# EAGLE design judo-devkit_v1 (EAGLE 9.6.2)

## Sheet 1 of 3
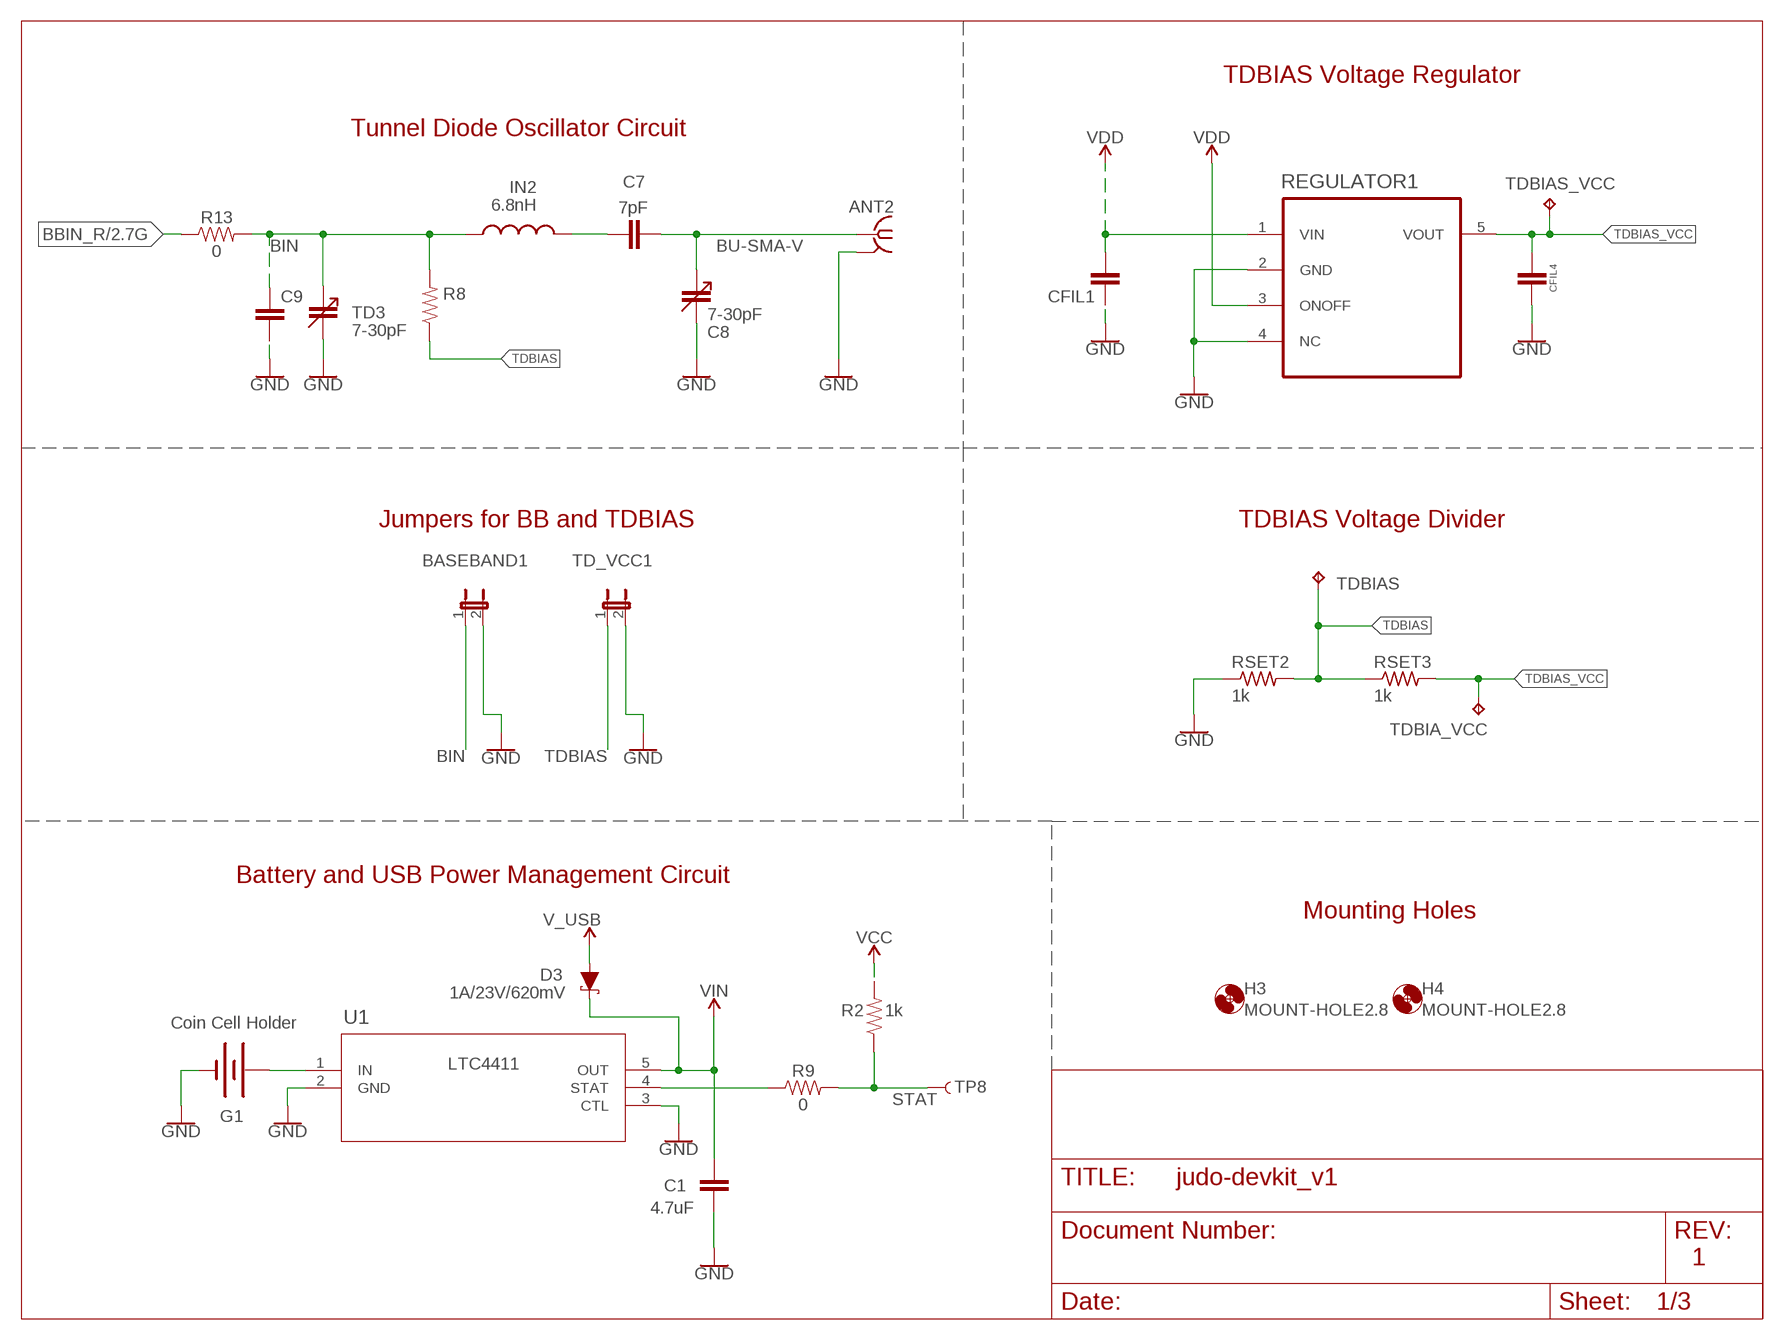
[diagram p0: schematic, sheet 1]

### Parts
BASEBAND1  JP1E  [JP1]
C1  4.7uF  CAPACITOR  [C0603]
C7  7pF  CAPACITOR  [C0603]
C8  7-30pF  CAP_ADJSMD  [CTZ3]
C9  CAP-0603  [0603]
CFIL1  0805_1  [0805_1PRIMARY]
CFIL4  0805_1  [0805_1PRIMARY]
D3  1A/23V/620mV  DIODE-SCHOTTKY-BAT20J  [SOD-323]
G1  Coin Cell Holder  BATTERY-20MM_SMD_4LEGS  [BATTCON_20MM_4LEGS]
H3  MOUNT-HOLE2.8  [2,8]
H4  MOUNT-HOLE2.8  [2,8]
IN2  6.8nH  0603_1  [0603_1PRIMARY]
R2  1k  1KOHM-0603-1/10W-1%  [0603]
R8  RESISTOR0805-RES  [0805]
R9  0  0OHM-0603-1/10W  [0603]
R13  0  0OHM-0603-1/10W  [0603]
REGULATOR1  S-1313B20  [SOT23-5]
RSET2  1k  R-US_R0603  [R0603]
RSET3  1k  R-US_R0603  [R0603]
TD3  7-30pF  CAP_ADJSMD  [CTZ3]
TD_VCC1  JP1E  [JP1]
TDBIA_VCC  TPPAD1-17  [P1-17]
TDBIAS  TPPAD1-17  [P1-17]
TDBIAS_VCC  TPPAD1-17  [P1-17]
TP8  TEST-POINT3X5  [PAD.03X.05]
TUNNELDIODE2  BU-SMA-V  [BU-SMA-V]
U1  LTC4411ES5TRMPBF  [SOT-5_S_LIT]

### Nets
ANT2: C7.2 C8.+ TUNNELDIODE2.1
BBIN_R: R13.1 ; also sheet 2
BIN: BASEBAND1.1 C9.1 IN2.1 R8.2 R13.2 TD3.+
GND: BASEBAND1.2 C1.1 C8.- C9.2 CFIL1.1 CFIL4.2 G1.NEGATIVE(-) REGULATOR1.2(GND) REGULATOR1.4(NC) RSET2.1 TD3.- TD_VCC1.2 TUNNELDIODE2.2 TUNNELDIODE2.3 TUNNELDIODE2.4 TUNNELDIODE2.5 U1.2(GND) U1.3(CTL) ; also sheet 2,3
N$1: G1.POSITIVE@1(+) G1.POSITIVE@2(+) G1.POSITIVE@3(+) G1.POSITIVE@4(+) U1.1(IN)
N$3: R9.1 U1.4(STAT)
N$5: C7.1 IN2.2
STAT: R2.1 R9.2 TP8.1
TDBIAS: R8.1 RSET2.2 RSET3.1 TD_VCC1.1 TDBIAS.TP
TDBIAS_VCC: CFIL4.1 REGULATOR1.5(VOUT) RSET3.2 TDBIA_VCC.TP TDBIAS_VCC.TP
V_USB: D3.A ; also sheet 2,3
VCC: R2.2 ; also sheet 2
VDD: CFIL1.2 REGULATOR1.1(VIN) REGULATOR1.3(ONOFF) ; also sheet 2,3
VIN: C1.2 D3.C U1.5(OUT) ; also sheet 2

### Notes on the sheet
- TDBIAS Voltage Regulator
- Tunnel Diode Oscillator Circuit
- Jumpers for BB and TDBIAS | TDBIAS Voltage Divider
- Battery and USB Power Management Circuit
- Mounting Holes
- 1

## Sheet 2 of 3
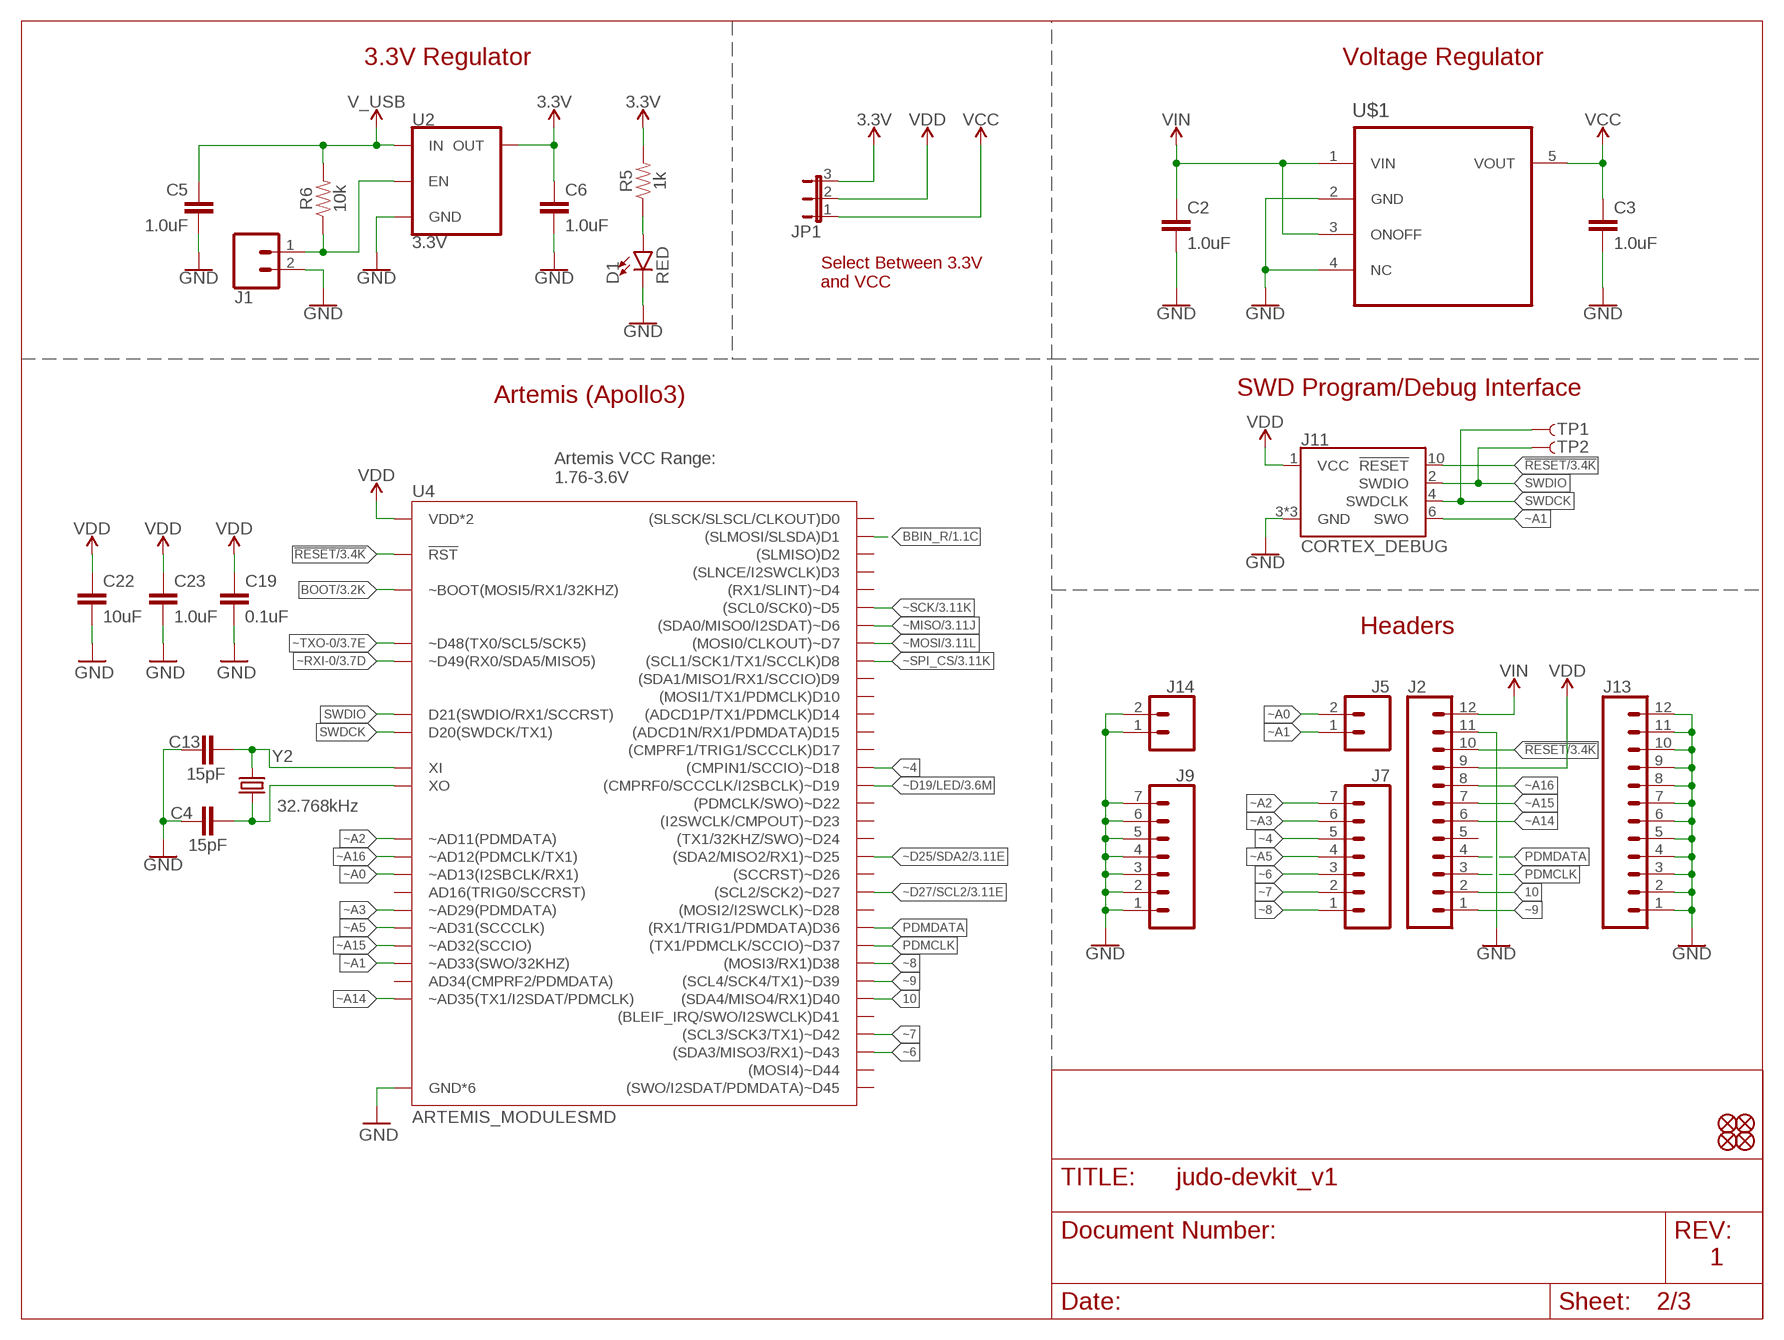
[diagram p1: schematic, sheet 2]

### Parts
C2  1.0uF  1.0UF-0402T-16V-10%  [0402-TIGHT]
C3  1.0uF  1.0UF-0402T-16V-10%  [0402-TIGHT]
C4  15pF  15PF-0603-50V-5%  [0603]
C5  1.0uF  1.0UF-0402T-16V-10%  [0402-TIGHT]
C6  1.0uF  1.0UF-0402T-16V-10%  [0402-TIGHT]
C13  15pF  15PF-0603-50V-5%  [0603]
C19  0.1uF  0.1UF-0402T-16V-10%  [0402-TIGHT]
C22  10uF  10UF-0603-6.3V-20%  [0603]
C23  1.0uF  1.0UF-0402T-16V-10%  [0402-TIGHT]
D1  RED  LED-RED0603  [LED-0603]
FD1  FIDUCIALUFIDUCIAL  [FIDUCIAL-MICRO]
FD2  FIDUCIALUFIDUCIAL  [FIDUCIAL-MICRO]
FD3  FIDUCIALUFIDUCIAL  [FIDUCIAL-MICRO]
FD4  FIDUCIALUFIDUCIAL  [FIDUCIAL-MICRO]
J1  CONN_021X02_NO_SILK  [1X02_NO_SILK]
J2  CONN_12NO_SILK  [1X12_NO_SILK]
J5  CONN_021X02_NO_SILK  [1X02_NO_SILK]
J7  CONN_07NO_SILK  [1X07_NO_SILK]
J9  CONN_07NO_SILK  [1X07_NO_SILK]
J11  CORTEX_DEBUG  CORTEX_JTAG_DEBUG_MINIMUM_PTH_NS  [2X5-PTH-1.27MM-NO_SILK]
J13  CONN_12NO_SILK  [1X12_NO_SILK]
J14  CONN_021X02_NO_SILK  [1X02_NO_SILK]
JP1  JP2E  [JP2]
R5  1k  1KOHM-0603-1/10W-1%  [0603]
R6  10k  10KOHM-0603-1/10W-1%  [0603]
TP1  TEST-POINT3X5  [PAD.03X.05]
TP2  TEST-POINT3X5  [PAD.03X.05]
U2  3.3V  V_REG_AP2112K-3.3V  [SOT23-5]
U4  ARTEMIS_MODULESMD  [ARTEMIS_FP]
U$1  CUSTOMCOMPONENTS_S-1313B20  [CUSTOMCOMPONENTS_SOT23-5]
Y2  32.768kHz  CRYSTAL-32.768KHZSMD-3.2X1.5  [CRYSTAL-SMD-3.2X1.5MM]

### Nets
3.3V: C6.1 JP1.3 R5.2 U2.5(OUT) ; also sheet 3
10: J2.2 U4.D40((SDA4/MISO4/RX1)D40)
!RESET: J2.10 J11.10(!RESET) U4.~RST(!RST) ; also sheet 3
BBIN_R: U4.D1((SLMOSI/SLSDA)D1) ; also sheet 1
BOOT: U4.BOOT(~BOOT(MOSI5/RX1/32KHZ)) ; also sheet 3
GND: C2.2 C3.2 C4.1 C5.2 C6.2 C13.1 C19.1 C22.2 C23.2 D1.C J1.2 J2.11 J9.1 J9.2 J9.3 J9.4 J9.5 J9.6 J9.7 J11.3(GND) J11.5(GND) J11.9(GND) J13.1 J13.2 J13.3 J13.4 J13.5 J13.6 J13.7 J13.8 J13.9 J13.10 J13.11 J13.12 J14.1 J14.2 U2.2(GND) U4.GND@1(GND*6) U4.GND@22(GND*6) U4.GND@38(GND*6) U4.GND@39(GND*6) U4.GND@47(GND*6) U4.GND@59(GND*6) U$1.2(GND) U$1.4(NC) ; also sheet 1,3
N$2: D1.A R5.1
N$7: C4.2 U4.XO Y2.P$2
N$8: C13.2 U4.XI Y2.P$1
PDMCLK: J2.3 U4.~D37((TX1/PDMCLK/SCCIO)~D37)
PDMDATA: J2.4 U4.D36((RX1/TRIG1/PDMDATA)D36)
SWDCK: J11.4(SWDCLK) TP1.1 U4.SWDCK(D20(SWDCK/TX1))
SWDIO: J11.2(SWDIO) TP2.1 U4.SWDIO(D21(SWDIO/RX1/SCCRST))
V_USB: C5.1 R6.2 U2.1(IN) ; also sheet 1,3
VCC: C3.1 JP1.1 U$1.5(VOUT) ; also sheet 1
VDD: C19.2 C22.1 C23.1 J2.9 J11.1(VCC) JP1.2 U4.VDD@36(VDD*2) U4.VDD@37(VDD*2) ; also sheet 1,3
VIN: C2.1 J2.12 U$1.1(VIN) U$1.3(ONOFF) ; also sheet 1
VREG_EN1: J1.1 R6.1 U2.3(EN)
~4: J7.5 U4.~D18((CMPIN1/SCCIO)~D18)
~6: J7.3 U4.~D43((SDA3/MISO3/RX1)~D43)
~7: J7.2 U4.~D42((SCL3/SCK3/TX1)~D42)
~8: J7.1 U4.D38((MOSI3/RX1)D38)
~9: J2.1 U4.~D39((SCL4/SCK4/TX1)~D39)
~A0: J5.2 U4.~AD13(~AD13(I2SBCLK/RX1))
~A1: J5.1 J11.6(SWO) U4.~AD33/SWO(~AD33(SWO/32KHZ))
~A2: J7.7 U4.~AD11(~AD11(PDMDATA))
~A3: J7.6 U4.~AD29(~AD29(PDMDATA))
~A5: J7.4 U4.~AD31(~AD31(SCCCLK))
~A14: J2.6 U4.~AD35(~AD35(TX1/I2SDAT/PDMCLK))
~A15: J2.7 U4.~AD32(~AD32(SCCIO))
~A16: J2.8 U4.~AD12(~AD12(PDMCLK/TX1))
~D19/LED: U4.~D19((CMPRF0/SCCCLK/I2SBCLK)~D19) ; also sheet 3
~D25/SDA2: U4.~D25((SDA2/MISO2/RX1)~D25) ; also sheet 3
~D27/SCL2: U4.~D27((SCL2/SCK2)~D27) ; also sheet 3
~MISO: U4.~D6((SDA0/MISO0/I2SDAT)~D6) ; also sheet 3
~MOSI: U4.D7((MOSI0/CLKOUT)~D7) ; also sheet 3
~RXI-0: U4.RXI-0(~D49(RX0/SDA5/MISO5)) ; also sheet 3
~SCK: U4.~D5((SCL0/SCK0)~D5) ; also sheet 3
~SPI_CS: U4.D8((SCL1/SCK1/TX1/SCCLK)D8) ; also sheet 3
~TXO-0: U4.TXO-0(~D48(TX0/SCL5/SCK5)) ; also sheet 3
Unconnected: J2.5 U4.AD16(AD16(TRIG0/SCCRST)) U4.AD34(AD34(CMPRF2/PDMDATA)) U4.D0((SLSCK/SLSCL/CLKOUT)D0) U4.D2((SLMISO)D2) U4.D3((SLNCE/I2SWCLK)D3) U4.D9((SDA1/MISO1/RX1/SCCIO)D9) U4.D10((MOSI1/TX1/PDMCLK)D10) U4.D14((ADCD1P/TX1/PDMCLK)D14) U4.D15((ADCD1N/RX1/PDMDATA)D15) U4.D17((CMPRF1/TRIG1/SCCCLK)D17) U4.D41((BLEIF_IRQ/SWO/I2SWCLK)D41) U4.~D4((RX1/SLINT)~D4) U4.~D22((PDMCLK/SWO)~D22) U4.~D23((I2SWCLK/CMPOUT)~D23) U4.~D24((TX1/32KHZ/SWO)~D24) U4.~D26((SCCRST)~D26) U4.~D28((MOSI2/I2SWCLK)~D28) U4.~D44((MOSI4)~D44) U4.~D45((SWO/I2SDAT/PDMDATA)~D45)

### Notes on the sheet
- 3.3V Regulator | Voltage Regulator
- Select Between 3.3V
  and VCC
- Artemis (Apollo3) | SWD Program/Debug Interface
- Artemis VCC Range:
  1.76-3.6V
- Headers
- 1

## Sheet 3 of 3
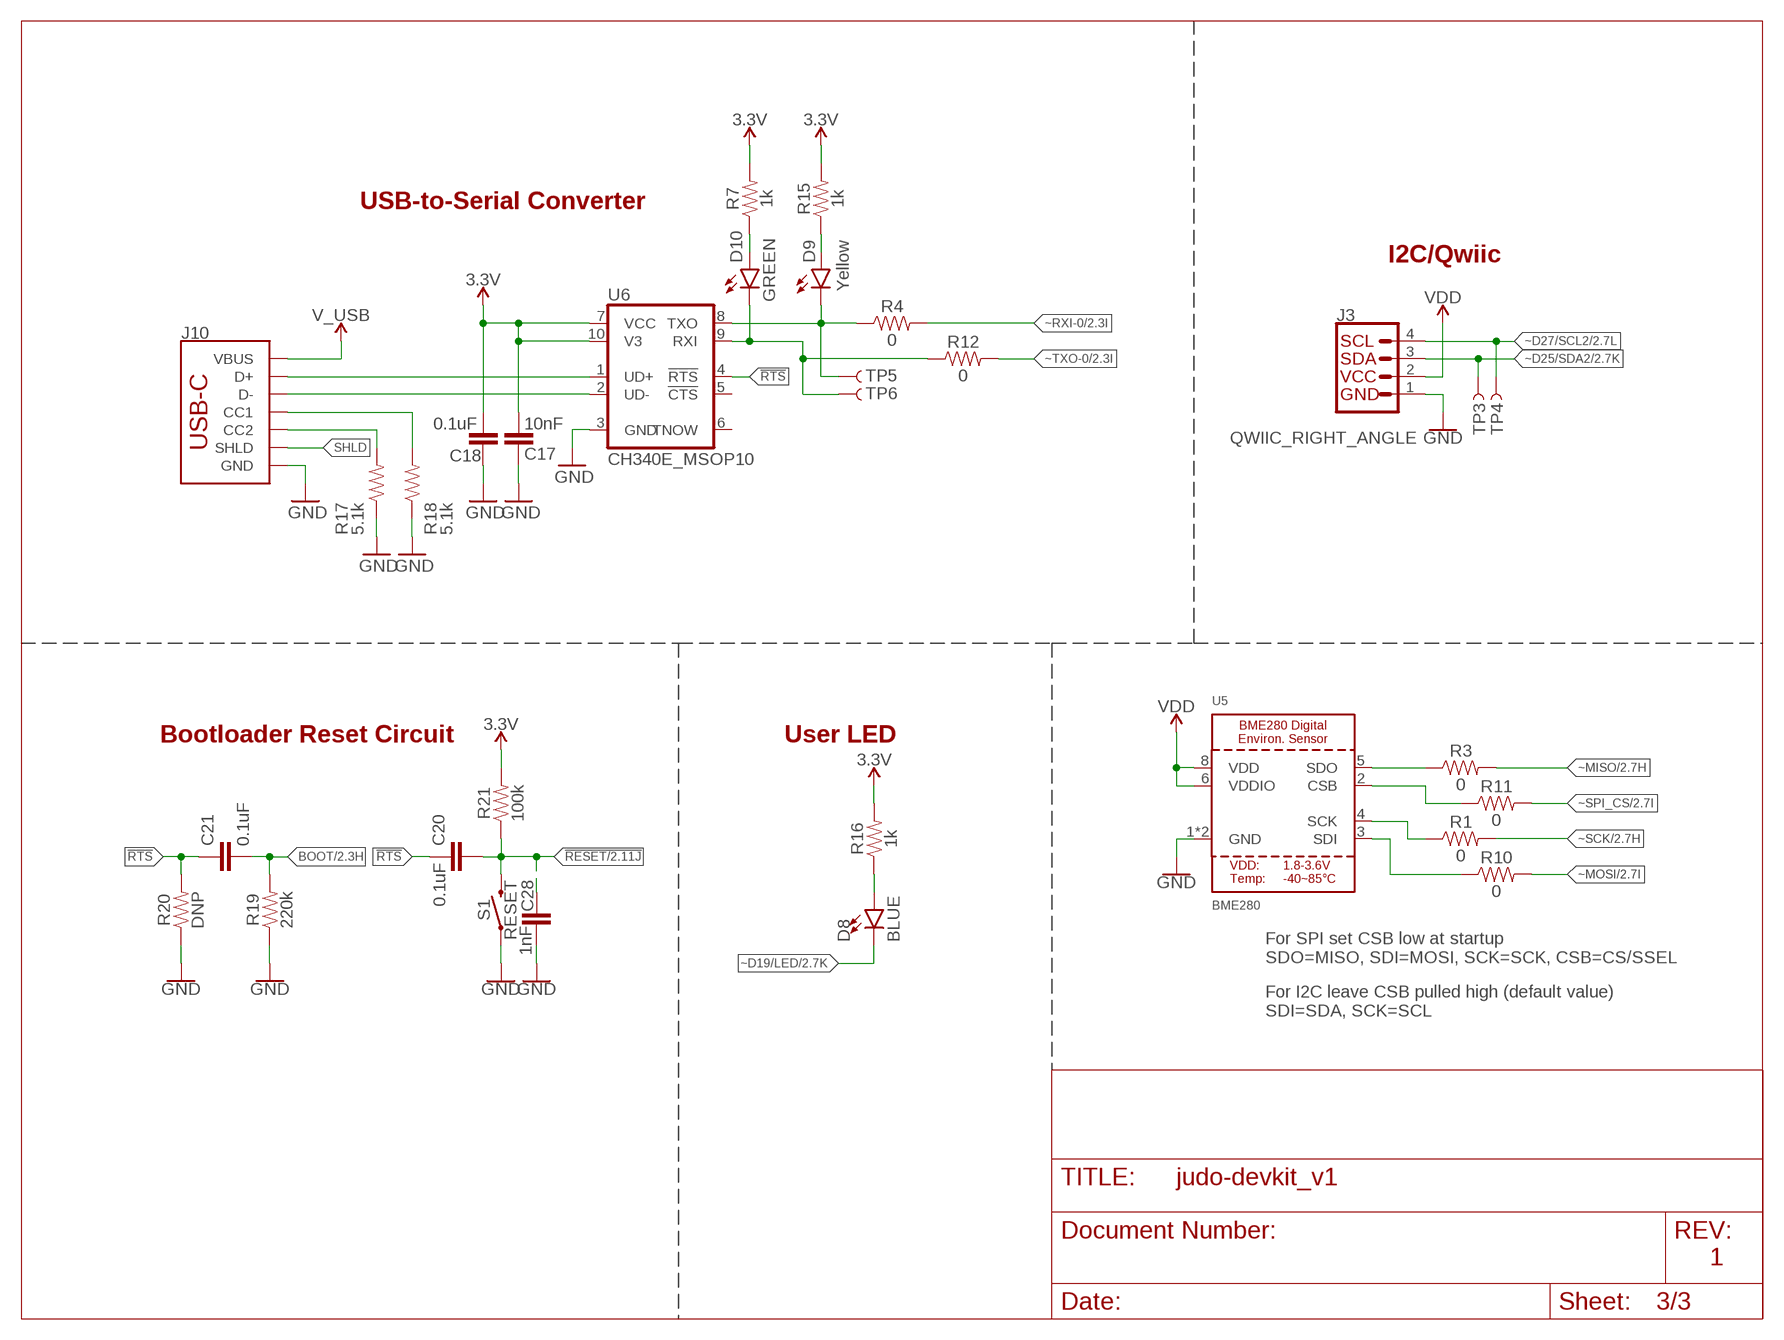
[diagram p2: schematic, sheet 3]

### Parts
C17  10nF  10NF-0603-50V-10%  [0603]
C18  0.1uF  0.1UF-0603-25V-(+80/-20%)  [0603]
C20  0.1uF  0.1UF-0603-25V-5%  [0603]
C21  0.1uF  0.1UF-0603-25V-5%  [0603]
C28  1nF  1.0NF/1000PF-0603-50V-10%  [0603]
D8  BLUE  LED-BLUE0603  [LED-0603]
D9  Yellow  LED-YELLOW0603  [LED-0603]
D10  GREEN  LED-GREEN0603  [LED-0603]
J3  QWIIC_RIGHT_ANGLE  QWIIC_CONNECTORJS-1MM  [JST04_1MM_RA]
J10  USB Female Type C Connector  USB_C_2-LAYER_PADS  [USB-C-16P-2LAYER-PADS]
R1  0  0OHM-0603-1/10W  [0603]
R3  0  0OHM-0603-1/10W  [0603]
R4  0  0OHM-0603-1/10W  [0603]
R7  1k  1KOHM-0603-1/10W-1%  [0603]
R10  0  0OHM-0603-1/10W  [0603]
R11  0  0OHM-0603-1/10W  [0603]
R12  0  0OHM-0603-1/10W  [0603]
R15  1k  1KOHM-0603-1/10W-1%  [0603]
R16  1k  1KOHM-0603-1/10W-1%  [0603]
R17  5.1k  5.1KOHM5.1KOHM-0603-1/10W-1%  [0603]
R18  5.1k  5.1KOHM5.1KOHM-0603-1/10W-1%  [0603]
R19  220k  220KOHM-0603-1/10W-1%  [0603]
R20  DNP  DNP-0603  [0603]
R21  100k  100KOHM-0603-1/10W-1%  [0603]
S1  RESET  MOMENTARY-SWITCH-SPST-SMD-4.6X2.8MM  [TACTILE_SWITCH_SMD_4.6X2.8MM]
TP3  TEST-POINT3X5  [PAD.03X.05]
TP4  TEST-POINT3X5  [PAD.03X.05]
TP5  TEST-POINT3X5  [PAD.03X.05]
TP6  TEST-POINT3X5  [PAD.03X.05]
U5  BME280  [BME280]
U6  CH340E_MSOP10  [MSOP10]

### Nets
3.3V: C17.1 C18.1 R7.2 R15.2 R16.2 R21.2 U6.7(VCC) U6.10(V3) ; also sheet 2
!RESET: C20.2 C28.1 R21.1 S1.3 S1.4 ; also sheet 2
!RTS: C20.1 C21.1 R20.2 U6.4(!RTS)
BOOT: C21.2 R19.2 ; also sheet 2
CC1: J10.A5(CC1) R18.2
CC2: J10.B5(CC2) R17.2
D+1: J10.A6(D+) J10.B6(D+) U6.1(UD+)
D-1: J10.A7(D-) J10.B7(D-) U6.2(UD-)
GND: C17.2 C18.2 C28.2 J3.1 J10.GND J10.GND2(GND) R17.1 R18.1 R19.1 R20.1 S1.1 S1.2 U5.1(GND) U5.7(GND) U6.3(GND) ; also sheet 1,2
N$4: R11.1 U5.2(CSB)
N$6: R3.1 U5.5(SDO)
N$9: D8.A R16.1
N$11: D10.A R7.1
N$12: D9.A R15.1
N$14: R1.1 U5.4(SCK)
N$15: R10.1 U5.3(SDI)
RXI-0_R: D9.C R4.1 TP5.1 U6.8(TXO)
SHLD: J10.SHLD1(SHLD) J10.SHLD2(SHLD) J10.SHLD3(SHLD) J10.SHLD4(SHLD)
TXO-0_R: D10.C R12.1 TP6.1 U6.9(RXI)
V_USB: J10.VBUS1(VBUS) J10.VBUS2(VBUS) ; also sheet 1,2
VDD: J3.2 U5.6(VDDIO) U5.8(VDD) ; also sheet 1,2
~D19/LED: D8.C ; also sheet 2
~D25/SDA2: J3.3 TP3.1 ; also sheet 2
~D27/SCL2: J3.4 TP4.1 ; also sheet 2
~MISO: R3.2 ; also sheet 2
~MOSI: R10.2 ; also sheet 2
~RXI-0: R4.2 ; also sheet 2
~SCK: R1.2 ; also sheet 2
~SPI_CS: R11.2 ; also sheet 2
~TXO-0: R12.2 ; also sheet 2
Unconnected: U6.5(!CTS) U6.6(TNOW)

### Notes on the sheet
- USB-to-Serial Converter
- I2C/Qwiic
- Bootloader Reset Circuit | User LED
- For SPI set CSB low at startup
  SDO=MISO, SDI=MOSI, SCK=SCK, CSB=CS/SSEL
- For I2C leave CSB pulled high (default value)
  SDI=SDA, SCK=SCL
- 1

## Library data of the parts
BASEBAND1 TD_VCC1 = jumper:JP1E: JUMPER
C1 C7 = Moo1.2:CAPACITOR
C2 C3 C5 C6 C23 = SparkFun-Capacitors:1.0UF: 1µF ceramic capacitors A capacitor is a passive two-terminal electrical component used to store electrical energy temporarily in an electric field.; PROD_ID: CAP-12417
C4 C13 = SparkFun-Capacitors:15PF: 15pF ceramic capacitors A capacitor is a passive two-terminal electrical component used to store electrical energy temporarily in an electric field.; PROD_ID: CAP-07881
C8 TD3 = SparkFun-Capacitors:CAP_ADJ: Variable, non-polarized capacitor
C9 = SparkFun-Capacitors:CAP
C17 = SparkFun-Capacitors:10NF: 0.01uF/10nF/10,000pF ceramic capacitors A capacitor is a passive two-terminal electrical component used to store electrical energy temporarily in an electric field. CAP-09321; PROD_ID: CAP-00867
C18 = SparkFun-Capacitors:0.1UF: 0.1µF ceramic capacitors A capacitor is a passive two-terminal electrical component used to store electrical energy temporarily in an electric field.; PROD_ID: CAP-00810
C19 = SparkFun-Capacitors:0.1UF: 0.1µF ceramic capacitors A capacitor is a passive two-terminal electrical component used to store electrical energy temporarily in an electric field.; PROD_ID: CAP-12416
C20 C21 = SparkFun-Capacitors:0.1UF: 0.1µF ceramic capacitors A capacitor is a passive two-terminal electrical component used to store electrical energy temporarily in an electric field.; PROD_ID: CAP-08604
C22 = SparkFun-Capacitors:10UF: 10.0µF ceramic capacitors A capacitor is a passive two-terminal electrical component used to store electrical energy temporarily in an electric field.; PROD_ID: CAP-11015
C28 = SparkFun-Capacitors:1.0NF/1000PF: 1nF/1,000pF ceramic capacitors A capacitor is a passive two-terminal electrical component used to store electrical energy temporarily in an electric field.; PROD_ID: CAP-07886
CFIL1 CFIL4 = Moo1.2:0805_1
D1 = SparkFun-LED:LED-RED: Red SMD LED Used in manufacturing of most products at SparkFun Packages: 0603 - KB - KingBright (DIO-17976) SMD 0603 package [Datasheet] <https://www.kingbrightusa.com/images/catalog/SPEC/APT1608SURCK.pdf> 0603 - (DIO-00819, has gone EOL) SMD 0603 package 0603 SMART - SMD 0603 SMART package ( more efficient and expensive)[Product Link] <http://www.osram-os.com/Graphics/XPic2/00077099_0.pdf> 1206 - SMD1206 package [Product Link] <https://www.sparkfun.com/datasheets/DevTools/LilyPad/Q150OVS4.pdff> SparkFun Products: Pro Mini 328 -5V <https://www.sparkfun.com/products/821> RedBoard <https://www.sparkfun.com/products/12757> IOIO-OTG <https://www.sparkfun.com/products/13613>; PROD_ID: DIO-00819
D3 = SparkFun-DiscreteSemi:DIODE-SCHOTTKY: Schottky diode A Schottky diode is a semiconductor diode which has a low forward voltage drop and a very fast switching action.; PROD_ID: DIO-11623
D8 = SparkFun-LED:LED-BLUE: Blue SMD LED Used in manufacturing of various products at SparkFun Packages: 0603 - SMD 0603 package [Product Link] <http://www.digikey.com/product-detail/en/SMLE12BC7TT86/511-1589-2-ND/1641808> 1206 - SMD1206 package [Product Link] <http://www.digikey.com/product-detail/en/lite-on-inc/LTST-C150TBKT/160-1643-1-ND/573584> SparkFun Products: ESP8266 Thing-Dev Board <https://www.sparkfun.com/products/13711> RedBoard <https://www.sparkfun.com/products/12757>; PROD_ID: DIO-08575
D9 = SparkFun-LED:LED-YELLOW: Yellow SMD LED Used in manufacturing several products at SparkFun. Packages: 0603 - SMD 0603 package[Product Link] <http://www.kingbrightusa.com/product.asp?catalog_name=LED&product_id=APT1608SYCK> 0603 -SMART - SMART SMD 0603 package (more efficient/more expensive) [Product Link] <http://www.osram-os.com/osram_os/en/products/product-catalog/led-light-emitting-diodes/smartled-0603/ly-l29k/index.jsp> LilyPad - SMD1206 package[Product Datasheet] <https://www.sparkfun.com/datasheets/DevTools/LilyPad/Q150YUS4.pdf> SparkFun Products: Blynk Board <https://www.sparkfun.com/products/13794> IOIO-OTG <https://www.sparkfun.com/products/13613> XBee Explorer Serial <https://www.sparkfun.com/products/13225>; PROD_ID: DIO-09003
D10 = SparkFun-LED:LED-GREEN: Green SMD LED Used in manufacturing of various products at SparkFun Packages: 0603 - SMD 0603 package [Product Link] <http://www.futureelectronics.com/en/technologies/semiconductors/optoelectronics/leds/Pages/9894312-LTST-C190GKT.aspx?CrossPart=HSMG-C190&IM=0> LilyPad 1206 - SMD1206 LilyPad package [Product Link] <http://www.futureelectronics.com/en/Technologies/Product.aspx?ProductID=IN150NGHARVATEKCORPORATION2049943&IM=0> 1206 - SMD1206 package [Product Link] <http://www.futureelectronics.com/en/technologies/semiconductors/optoelectronics/leds/Pages/8315665-LTST-C150KGKT.aspx?IM=0> 1206 Bottom Mount -SMD 1206 Bottom Mount [Product Link] <http://www.digikey.com/product-detail/en/lite-on-inc/LTST-C230KGKT/160-1456-1-ND/386854> SparkFun Products: Pro Mini 328 -5V <https://www.sparkfun.com/products/821> RedBoard <https://www.sparkfun.com/products/12757> MP3 Trigger <https://www.sparkfun.com/products/13720> Makey Makey <https://www.sparkfun.com/products/11076>; PROD_ID: DIO-00821
FD1-FD4 = SparkFun-Aesthetics:FIDUCIAL: Fiducial Alignment Points Point-of-reference for pick-and-place machines and other optical instruments.
G1 = SparkFun-Batteries:BATTERY: Battery - Single Cell A variety of battery chemistries, sizes, and footprints. Device List: 20MM_PTH - Coin Cell Battery Holder - 20mm (PTH) <https://www.sparkfun.com/products/783> 20MM_PTH_KIT- Coin Cell battery Holder - 20 mm (PTH) <http://www.sparkfun.com/products/783>kit version with special mask 6.8MM_PTH - Coin Cell Battery Holder - 6.8MM(SMD) <https://www.digikey.com/product-detail/en/seiko-instruments/MS621FE-FL11E/728-1057-ND/1889208?WT.srch=1&gclid=CNOQ5a6LzdQCFZS2wAodXCkE0g> 12MM_SMD - Coin Cell Battery Holder - 12mm (SMD) <https://www.sparkfun.com/products/10592> 12MM_PTH - Coin Cell Battery Holder - 12mm (PTH) <https://www.sparkfun.com/products/7948> 20MM_SMD - 20mm Coin Cell Battery Holder (SMD) (2 legs) Used on the Big Time Watch Kit <https://www.sparkfun.com/products/11734> 20MM_SMD_4LEGS - Coin Cell Battery Holder - 20mm (SMD) <https://www.sparkfun.com/products/11892> 20MM_SMD_4LEGS_OVERPASTE - Coin Cell Battery Holder - 20mm (SMD) <https://www.sparkfun.com/products/11892> (Over-paste on the legs) 24.5MM_PTH - Coin Cell Battery Holder - 24.5mm (PTH) <https://www.sparkfun.com/products/8863> 9V - 9V Battery Holder - PC Mount Used on the SparkFun SparkPunk Sound Kit <https://www.sparkfun.com/products/11177> and SparkFun SparkPunk Sequencer Kit <https://www.sparkfun.com/products/12707> 18650 - Battery Holder - 18650 (PTH) <https://www.sparkfun.com/products/13113> AA - Battery Holder - 1xAA (PTH) <https://www.sparkfun.com/products/7949> AAA - Battery Holder - 1xAAA (PTH) <https://www.sparkfun.com/products/12718> AA_KIT - Battery Holder - 1xAA (PTH) <https://www.sparkfun.com/products/7949> Special kit package - pads only have exposed copper on one side of the board. AAA_KIT - Battery Holder - 1xAAA (PTH) <https://www.sparkfun.com/products/12718> Special kit package - pads only have exposed copper on one side of the board.; PROD_ID: BATT-10373; SF_SKU: PRT-11892
H3 H4 = holes:MOUNT-HOLE: MOUNTING HOLE with drill center marker
IN2 = Moo1.2:0603_1
J1 J5 J14 = SparkFun-Connectors:CONN_02: Multi connection point. Often used as Generic Header-pin footprint for 0.1 inch spaced/style header connections On any of the 0.1 inch spaced packages, you can populate with these: Break Away Headers - Straight <https://www.sparkfun.com/products/116> (PRT-00116) Break Away Male Headers - Right Angle <https://www.sparkfun.com/products/553> (PRT-00553) Female Headers <https://www.sparkfun.com/products/115> (PRT-00115) Break Away Headers - Machine Pin <https://www.sparkfun.com/products/117> (PRT-00117) Break Away Female Headers - Swiss Machine Pin <https://www.sparkfun.com/products/743> (PRT-00743) For SCREWTERMINALS and SPRING TERMINALS visit here: Screw Terimnals on SparkFun.com <https://www.sparkfun.com/search/results?term=Screw+Terminals> (5mm/3.5mm/2.54mm spacing) This device is also useful as a general connection point to wire up your design to another part of your project. Our various solder wires solder well into these plated through hole pads. Hook-Up Wire - Assortment (Stranded, 22 AWG) <https://www.sparkfun.com/products/11375> (PRT-11375) Hook-Up Wire - Assortment (Solid Core, 22 AWG) <https://www.sparkfun.com/products/11367> (PRT-11367) View the entire wire category on our website here <https://www.sparkfun.com/categories/141> Special notes: Molex polarized connector foot print use with: PRT-08233 with associated crimp pins and housings. 2.54_SCREWTERM for use with PRT-10571. 3.5mm Screw Terminal footprints for PRT-08084 5mm Screw Terminal footprints for use with PRT-08432
J2 J13 = SparkFun-Connectors:CONN_12: Multi connection point. Often used as Generic Header-pin footprint for 0.1 inch spaced/style header connections On any of the 0.1 inch spaced packages, you can populate with these: Break Away Headers - Straight <https://www.sparkfun.com/products/116> (PRT-00116) Break Away Male Headers - Right Angle <https://www.sparkfun.com/products/553> (PRT-00553) Female Headers <https://www.sparkfun.com/products/115> (PRT-00115) Break Away Headers - Machine Pin <https://www.sparkfun.com/products/117> (PRT-00117) Break Away Female Headers - Swiss Machine Pin <https://www.sparkfun.com/products/743> (PRT-00743) For SCREWTERMINALS and SPRING TERMINALS visit here: Screw Terimnals on SparkFun.com <https://www.sparkfun.com/search/results?term=Screw+Terminals> (5mm/3.5mm/2.54mm spacing) This device is also useful as a general connection point to wire up your design to another part of your project. Our various solder wires solder well into these plated through hole pads. Hook-Up Wire - Assortment (Stranded, 22 AWG) <https://www.sparkfun.com/products/11375> (PRT-11375) Hook-Up Wire - Assortment (Solid Core, 22 AWG) <https://www.sparkfun.com/products/11367> (PRT-11367) View the entire wire category on our website here <https://www.sparkfun.com/categories/141> Special notes: Molex polarized connector foot print use with SKU : PRT-08231 with associated crimp pins and housings. 1MM SMD Version SKU: PRT-10208 NOTES ON THE VARIANTS LOCK and LOCK_LONGPADS... This footprint was designed to help hold the alignment of a through-hole component (i.e. 6-pin header) while soldering it into place. You may notice that each hole has been shifted either up or down by 0.005 of an inch from it's more standard position (which is a perfectly straight line). This slight alteration caused the pins (the squares in the middle) to touch the edges of the holes. Because they are alternating, it causes a "brace" to hold the component in place. 0.005 has proven to be the perfect amount of "off-center" position when using our standard breakaway headers. Although looks a little odd when you look at the bare footprint, once you have a header in there, the alteration is very hard to notice. Also,if you push a header all the way into place, it is covered up entirely on the bottom side.
J3 = SparkFun-Connectors:QWIIC_CONNECTOR: SparkFun I2C Standard Qwiic Connector An SMD 1mm pitch JST connector makes it easy and quick (get it? Qwiic?) to connect I2C devices to each other. The Qwiic system <http://www.sparkfun.com/qwiic> enables fast and solderless connection between popular platforms and various sensors and actuators. We carry 200mm <https://www.sparkfun.com/products/14204>, 100mm <https://www.sparkfun.com/products/14205>, 50mm <https://www.sparkfun.com/products/14206>, and breadboard friendly <https://www.sparkfun.com/products/14207> Qwiic cables. We also offer 10 pcs strips <https://www.sparkfun.com/products/14323> the SMD connectors.; PROD_ID: CONN-13694
J7 J9 = SparkFun-Connectors:CONN_07: Multi connection point. Often used as Generic Header-pin footprint for 0.1 inch spaced/style header connections On any of the 0.1 inch spaced packages, you can populate with these: Break Away Headers - Straight <https://www.sparkfun.com/products/116> (PRT-00116) Break Away Male Headers - Right Angle <https://www.sparkfun.com/products/553> (PRT-00553) Female Headers <https://www.sparkfun.com/products/115> (PRT-00115) Break Away Headers - Machine Pin <https://www.sparkfun.com/products/117> (PRT-00117) Break Away Female Headers - Swiss Machine Pin <https://www.sparkfun.com/products/743> (PRT-00743) For SCREWTERMINALS and SPRING TERMINALS visit here: Screw Terimnals on SparkFun.com <https://www.sparkfun.com/search/results?term=Screw+Terminals> (5mm/3.5mm/2.54mm spacing) This device is also useful as a general connection point to wire up your design to another part of your project. Our various solder wires solder well into these plated through hole pads. Hook-Up Wire - Assortment (Stranded, 22 AWG) <https://www.sparkfun.com/products/11375> (PRT-11375) Hook-Up Wire - Assortment (Solid Core, 22 AWG) <https://www.sparkfun.com/products/11367> (PRT-11367) View the entire wire category on our website here <https://www.sparkfun.com/categories/141> Special notes: Molex polarized connector foot print use with SKU : PRT-08231 with associated crimp pins and housings. 1MM SMD Version SKU: PRT-10208 NOTES ON THE VARIANTS LOCK and LOCK_LONGPADS... This footprint was designed to help hold the alignment of a through-hole component (i.e. 6-pin header) while soldering it into place. You may notice that each hole has been shifted either up or down by 0.005 of an inch from it's more standard position (which is a perfectly straight line). This slight alteration caused the pins (the squares in the middle) to touch the edges of the holes. Because they are alternating, it causes a "brace" to hold the component in place. 0.005 has proven to be the perfect amount of "off-center" position when using our standard breakaway headers. Although looks a little odd when you look at the bare footprint, once you have a header in there, the alteration is very hard to notice. Also,if you push a header all the way into place, it is covered up entirely on the bottom side.
J10 = SparkFun-Connectors:USB_C: USB Type C 16Pin Connector Super Speed pins not available on the 16-pin purely SMD connector so this part is best for USB 2.0 implementations. D1 and D2 are tied together enabling D+/- no matter which way the cable is plugged into the connector. The two channel configuration pins (CC1/2) are exposed. These are normally connected to ground via 5.1k resistors but can be reconfigured for high current/high power applications. **4-LAYER BOARD WARNING!!** If designing 4-layer board, make sure to select the variant _4-LAYER-ISOLATED. The linked footprint (USB-C-16-4LAYER-ISOLATED) includes some very necessary cutout polygons in the inner layers (2 and 15). This prevents the PTH mounting shield legs on the USB connector from electrically connecting any other polygons on the inner layers (usually VCC and GND).; PROD_ID: CONN-14122
J11 = SparkFun-Connectors:CORTEX_JTAG_DEBUG_MINIMUM: Cortex Debug Connector - 10 pin Supports JTAG debug, Serial Wire debug, and Serial Wire Viewer. PTH and SMD connector options available. General Connector Information <http://infocenter.arm.com/help/topic/com.arm.doc.faqs/attached/13634/cortex_debug_connectors.pdf> Products: PTH Connector <http://www.digikey.com/product-detail/en/cnc-tech/3220-10-0100-00/1175-1627-ND/3883661> -via Digi-Key SparkFun PSoc <https://www.sparkfun.com/products/13229> SparkFun T <https://www.sparkfun.com/products/13810>
JP1 = jumper:JP2E: JUMPER
R1 R3 R4 R9-R13 = SparkFun-Resistors:0OHM: 0Ω resistor A resistor is a passive two-terminal electrical component that implements electrical resistance as a circuit element. Resistors act to reduce current flow, and, at the same time, act to lower voltage levels within circuits. - Wikipedia; PROD_ID: RES-08609
R2 R5 R7 R15 R16 = SparkFun-Resistors:1KOHM: 1kΩ resistor A resistor is a passive two-terminal electrical component that implements electrical resistance as a circuit element. Resistors act to reduce current flow, and, at the same time, act to lower voltage levels within circuits. - Wikipedia; PROD_ID: RES-07856
R6 = SparkFun-Resistors:10KOHM: 10kΩ resistor A resistor is a passive two-terminal electrical component that implements electrical resistance as a circuit element. Resistors act to reduce current flow, and, at the same time, act to lower voltage levels within circuits. - Wikipedia; PROD_ID: RES-00824
R8 = SparkFun-Resistors:RESISTOR: Resistor Basic schematic elements and footprints for 0603, 1206, and PTH resistors.
R17 R18 = SparkFun-Resistors:5.1KOHM; PROD_ID: RES-12083
R19 = SparkFun-Resistors:220KOHM: 220kΩ resistor A resistor is a passive two-terminal electrical component that implements electrical resistance as a circuit element. Resistors act to reduce current flow, and, at the same time, act to lower voltage levels within circuits. - Wikipedia; PROD_ID: RES-08969
R20 = SparkFun-Resistors:DNP: Do-Not-Populate resistor A resistor is a passive two-terminal electrical component that implements electrical resistance as a circuit element. Resistors act to reduce current flow, and, at the same time, act to lower voltage levels within circuits. - Wikipedia
R21 = SparkFun-Resistors:100KOHM: 100kΩ resistor A resistor is a passive two-terminal electrical component that implements electrical resistance as a circuit element. Resistors act to reduce current flow, and, at the same time, act to lower voltage levels within circuits. - Wikipedia; PROD_ID: RES-07828
REGULATOR1 = customcomponents:S-1313B20
RSET2 RSET3 = rcl:R-US_: RESISTOR, American symbol
S1 = SparkFun-Switches:MOMENTARY-SWITCH-SPST: Momentary Switch (Pushbutton) - SPST Normally-open (NO) SPST momentary switches (buttons, pushbuttons). Variants PTH-12MM - 12mm square, through-hole Momentary Pushbutton Switch - 12mm Square <https://www.sparkfun.com/products/9190> (COM-09190) PTH-6.0MM, PTH-6.0MM-KIT - 6.0mm square, through-hole Mini Pushbutton Switch <https://www.sparkfun.com/products/97> (COM-00097) KIT package intended for soldering kit's - only one side of pads' copper is exposed. PTH-RIGHT-ANGLE-KIT - Right-angle, through-hole Right Angle Tactile Button <https://www.sparkfun.com/products/10791> - Used on SparkFun BigTime Watch Kit <https://www.sparkfun.com/products/11734> SMD-12MM - 12mm square, surface-mount Tactile Button - SMD (12mm) <https://www.sparkfun.com/products/12993> (COM-12993) Used on SparkFun PicoBoard <https://www.sparkfun.com/products/11888> SMD-4.5MM - 4.5mm Square Trackball Switch Used on SparkFun Blackberry Trackballer Breakout <https://www.sparkfun.com/products/13169> SMD-4.6MMX2.8MM - 4.60mm x 2.80mm, surface mount Used on SparkFun Pro Micro - RP2040 <https://www.sparkfun.com/products/17717> SMD-5.2MM, SMD-5.2-REDUNDANT - 5.2mm square, surface-mount Mini Pushbutton Switch - SMD <https://www.sparkfun.com/products/8720> (COM-08720) Used on Arduino Pro Mini <https://www.sparkfun.com/products/11114> REDUNDANT package connects both switch circuits together SMD-6.0X3.5MM - 6.0 x 3.5mm, surface mount Momentary Reset Switch SMD <https://www.sparkfun.com/products/8229> (COM-08229) SMD-6.2MM-TALL - 6.2mm square, surface mount Tactile Button - SMD (6mm) <https://www.sparkfun.com/products/12992> Used on SparkFun Digital Sandbox <https://www.sparkfun.com/products/12651> SMD-RIGHT-ANGLE - Right-angle, surface mount Used on SparkFun Block for Intel® Edison - Arduino <https://www.sparkfun.com/products/13036>; PROD_ID: SWCH-15606
TDBIA_VCC TDBIAS TDBIAS_VCC = testpad:TP: Test pad
TP1-TP6 TP8 = SparkFun-Connectors:TEST-POINT: SparkFun Test Points Bare copper test points for troubleshooting or In-Circuit-Testing. These are used by our Production team for verifying production board runs using pogo-pins on test beds. SparkFun Products: SparkFun LSM9DS1 Breakout <https://www.sparkfun.com/products/13284> SparkFun PSOC <https://www.sparkfun.com/products/13714> SparkFun Load Cell Amplifier <https://www.sparkfun.com/products/13879>
TUNNELDIODE2 = con-coax:BU-SMA-V: FEMALE SMA CONNECTOR Radiall distributor RS 112-3794; OC_FARNELL: unknown; OC_NEWARK: unknown
U1 = ltc4411:LTC4411ES5TRMPBF; COPYRIGHT: Copyright (C) 2023 Ultra Librarian. All rights reserved.; MANUFACTURER_PART_NUMBER: LTC4411; MFR_NAME: Analog Devices Inc
U2 = SparkFun-IC-Power:V_REG_AP2112: AP2112 - 600mA CMOS LDO Regulator w/ Enable The AP2112 is CMOS process low dropout linear regulator with enable function, the regulator delivers a guaranteed 600mA (min.) continuous load current. Features Output Voltage Accuracy: ±1.5% Output Current: 600mA (Min.) Foldback Short Current Protection: 50mA Enable Function to Turn ON/OFF VOUT Low Dropout Voltage (3.3V): 250mV (Typ.) @IOUT=600mA Excellent Load Regulation: 0.2%/A (Typ.) Excellent Line Regulation: 0.02%/V (Typ.) Low Quiescent Current: 55μA (Typ.) Low Standby Current: 0.01μA (Typ.) Low Output Noise: 50μVRMS PSRR: 100Hz -65dB, 1kHz -65dB OTSD Protection Stable with 1.0μF Flexible Cap: Ceramic, Tantalum and Aluminum Electrolytic Operation Temperature Range: -40°C to 85°C ESD: MM 400V, HBM 4000V; PROD_ID: VREG-12457
U4 = SparkFun-IC-Microcontroller:ARTEMIS_MODULE: Description: The Artemis Module from SparkFun is a Cortex-M4F with BLE 5.0 running up to 96MHz and with as low power as 6uA per MHz (less than 5mW). This is the world's first module to bridge the market between hobbyists and consumer products. We've packaged all the power of a modern microcontroller into a module that is both extremely easy to use but is mass-market ready. The flexibility of the Artemis module starts with our [Arduino core](https://github.com/sparkfun/Arduino_Apollo3). You can program and use the Artemis module just like you would an Uno or any other Arduino. Time to first blink is just 5 minutes away! We built the core from the ground up, making it fast and as light weight as possible.; PROD_ID: SUB-14415
U5 = microbuilder:BME280: BME280 - Environmental Sensor (I2C + SPI)
U6 = SparkFun-IC-Comms:CH340E; PROD_ID: IC-14135
U$1 = tunnelradio_02:CUSTOMCOMPONENTS_S-1313B20
Y2 = SparkFun-Clocks:CRYSTAL-32.768KHZ: 32.768kHz Crystal Frequency: 32.768kHz Frequency Stability: ±20ppm Load Capacitance: 12.5pF (PTH-2X6 & SMD-3.2X1.5), 6pF (SMD-2X6) SparkFun Products: SparkFun BigTime Watch Kit <https://www.sparkfun.com/products/11734> SparkFun nRF52832 Breakout <https://www.sparkfun.com/products/13990> SparkFun Real Time Clock Module <https://www.sparkfun.com/products/12708>; PROD_ID: XTAL-13062

## Net classes
1 power: width 0.762 mm

## Board
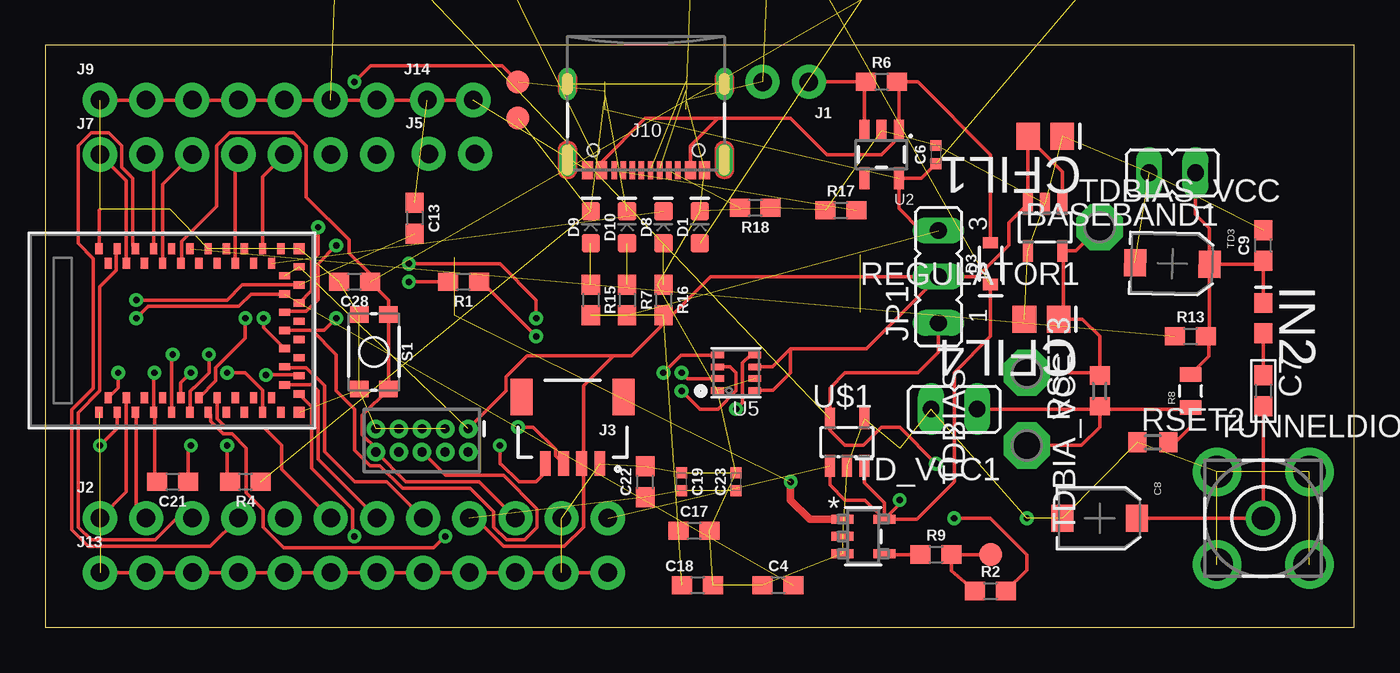
[diagram p3: board, top side]
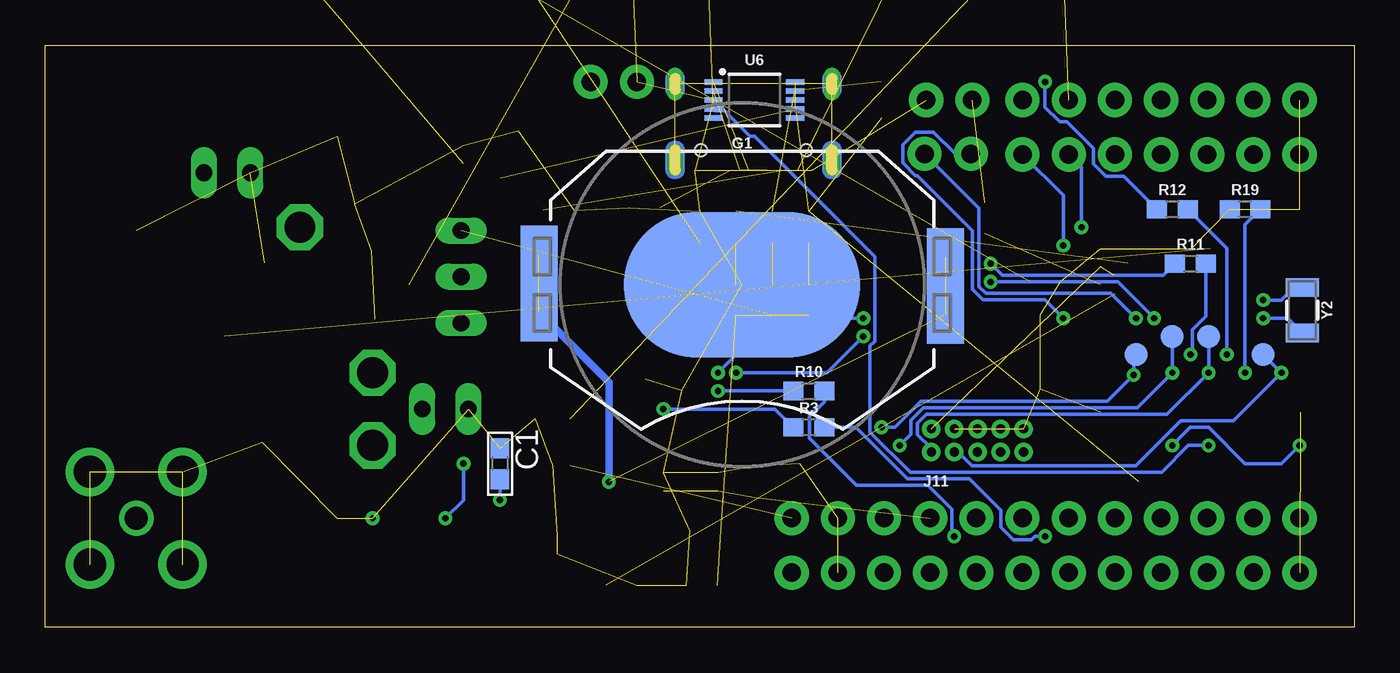
[diagram p4: board, bottom side, seen from below]

Size 72 x 32 mm. Coordinates in mm from the lower left corner, seen from the top.
Outline: 0,0 72,0 72,32 0,32 0,0
Copper layers (1*16): Top 0.035mm / dielectric 1.5mm / Bottom 0.035mm
Design rules "default": minimum track width 6mil, minimum drill 0.35mm, track to track 6mil, track to pad 6mil, pad to pad 6mil, via to via 6mil, smd to smd 6mil, copper to edge 40mil, drill to drill 6mil, minimum pad ring 10mil, minimum via ring 8mil, stop-mask expansion 4mil, vias tented up to drill 0mil, thermal gap 10mil

### Footprints (pad centres in the part's own frame; a part is rotated, then mirrored left to right if it is on the bottom)
JP1 = drill 0.914 long: 1 0,-1.27; 2 0,1.27
C0603 = smd 1.1 x 1: 1 -0.85,0; 2 0.85,0
0402-TIGHT = smd 0.6 x 0.6: 1 -0.5,0; 2 0.5,0
0603 = smd 1.1 x 1: 1 -0.85,0; 2 0.85,0
CTZ3 = smd 1.5 x 1.2: + 0,2.05; - 0,-2.05
0805_1PRIMARY = smd 1.295 x 1.499: 1 -0.94,0; 2 0.94,0
LED-0603 = smd 1 x 1: A -0.877,0; C 0.877,0
SOD-323 = smd 0.63 x 0.83: A 1.15,0; C -1.15,0
FIDUCIAL-MICRO = smd 0.635 x 0.635: 1 0,0
BATTCON_20MM_4LEGS = smd 13 x 8: NEGATIVE 0,0 | smd 2.032 x 3.175: POSITIVE@1 -11.176,1.651; POSITIVE@2 -11.176,-1.524; POSITIVE@3 11.176,1.524; POSITIVE@4 11.176,-1.651
2,8 = hole 2.8: 0,0
0603_1PRIMARY = smd 1.092 x 0.991: 1 -0.838,0; 2 0.838,0
1X02_NO_SILK = drill 1.016 pad 1.88: 1 0,0; 2 2.54,0
1X12_NO_SILK = drill 1.016 pad 1.88: 1 0,0; 2 2.54,0; 3 5.08,0; 4 7.62,0; 5 10.16,0; 6 12.7,0; 7 15.24,0; 8 17.78,0; 9 20.32,0; 10 22.86,0; 11 25.4,0; 12 27.94,0
JST04_1MM_RA = smd 0.6 x 1.35: 1 -1.5,0; 2 -0.5,0; 3 0.5,0; 4 1.5,0 | smd 1.2 x 2: NC1 2.8,-3.675; NC2 -2.8,-3.675
1X07_NO_SILK = drill 1.016 pad 1.88: 1 0,0; 2 2.54,0; 3 5.08,0; 4 7.62,0; 5 10.16,0; 6 12.7,0; 7 15.24,0
USB-C-16P-2LAYER-PADS = smd 0.3 x 1: A5 -1.25,-0.34; A6 -0.25,-0.34; A7 0.25,-0.34; A8 1.25,-0.34; B5 1.75,-0.34; B6 0.75,-0.34; B7 -0.75,-0.34; B8 -1.75,-0.34 | smd 0.6 x 1: GND -3.225,-0.34; GND2 3.225,-0.34; VBUS1 -2.45,-0.34; VBUS2 2.45,-0.34 | drill 0.4 pad 0.6 long: SHLD1 -4.318,-0.915; SHLD2 4.318,-0.915; SHLD3 -4.318,-5.095; SHLD4 4.318,-5.095 | hole 0.65: -2.89,-1.445; 2.89,-1.445
2X5-PTH-1.27MM-NO_SILK = drill 0.508 pad 1: 1 -2.54,-0.635; 2 -2.54,0.635; 3 -1.27,-0.635; 4 -1.27,0.635; 5 0,-0.635; 6 0,0.635; 7 1.27,-0.635; 8 1.27,0.635; 9 2.54,-0.635; 10 2.54,0.635
JP2 = drill 0.914 long: 1 -2.54,0; 2 0,0; 3 2.54,0
0805 = smd 0.8 x 1.2: 1 -0.9,0; 2 0.9,0
SOT23-5 = smd 0.55 x 1.2: 1 -0.95,-1.3; 2 0,-1.3; 3 0.95,-1.3; 4 0.95,1.3; 5 -0.95,1.3
R0603 = smd 1 x 1.1: 1 -0.85,0; 2 0.85,0
TACTILE_SWITCH_SMD_4.6X2.8MM = smd 0.9 x 1: 1 -2.05,-0.8; 2 2.05,-0.8; 3 2.05,0.8; 4 -2.05,0.8
P1-17 = drill 1.702 pad 2.54 octagon: TP 0,0
PAD.03X.05 = smd 1.27 x 1.27: 1 0,0
BU-SMA-V = drill 1.27: 1 0,0 | drill 1.778: 2 -2.55,2.55; 3 2.55,2.55; 4 2.55,-2.55; 5 -2.55,-2.55
SOT-5_S_LIT = smd 1.211 x 0.501: 1 -1.15,0.95; 2 -1.15,0; 3 -1.15,-0.95; 4 1.15,-0.95; 5 1.15,0.95
ARTEMIS_FP = smd 0.4 x 0.6: AD16 -4,-3.7; BOOT 1.5,4.5; D0 0.5,-4.5; D1 -0.5,-4.5; D2 -1,-3.7; D3 2,-3.7; D7 -1.5,4.5; D8 -0.5,4.5; D9 2,3.7; D10 1,3.7; D14 -5,3.7; D17 -3.5,-4.5; D36 2.5,-4.5; D38 3,-3.7; D40 2.5,4.5; D41 -2.5,-4.5; GND@1 4.5,4.5; GND@39 -5.5,-4.5; GND@47 -1.5,-4.5; GND@59 4.5,-4.5; RXI-0 3.5,4.5; SWDCK 4,3.7; SWDIO 0,3.7; TXO-0 0.5,4.5; ~AD31 -3,-3.7; ~AD35 -2,3.7; ~D4 -2.5,4.5; ~D5 -1,3.7; ~D18 -4.5,-4.5; ~D19 -5,-3.7; ~D22 -3.5,4.5; ~D23 -4,3.7; ~D24 -3,3.7; ~D27 -4.5,4.5; ~D28 -5.5,4.5; ~D37 3.5,-4.5; ~D39 3,3.7; ~D42 1.5,-4.5; ~D43 1,-3.7; ~D44 4,-3.7; ~D45 -2,-3.7; ~RST 0,-3.7 | smd 0.6 x 0.4: AD34 -6.5,-0.5; D15 -6.5,0.5; VDD@36 -5.7,-3; VDD@37 -6.5,-3.5; XI -6.5,-2.5; XO -5.7,-2; ~AD11 -5.7,-1; ~AD12 -5.7,2; ~AD13 -5.7,1; ~AD29 -6.5,-1.5; ~AD32 -5.7,3; ~AD33/SWO -5.7,0; ~D6 -6.5,3.5; ~D25 -6.5,2.5; ~D26 -6.5,1.5 | smd 0.6 x 0.6: GND@22 -6.5,4.5; GND@38 -6.5,-4.5
BME280 = smd 0.7 x 0.35: 1 1.025,0.975; 2 1.025,0.325; 3 1.025,-0.325; 4 1.025,-0.975; 5 -1.025,-0.975; 6 -1.025,-0.325; 7 -1.025,0.325; 8 -1.025,0.975
MSOP10 = smd 1 x 0.3: 1 -2.25,1; 2 -2.25,0.5; 3 -2.25,0; 4 -2.25,-0.5; 5 -2.25,-1; 6 2.25,-1; 7 2.25,-0.5; 8 2.25,0; 9 2.25,0.5; 10 2.25,1
CUSTOMCOMPONENTS_SOT23-5 = smd 0.55 x 1.2: 1 -0.95,-1.3; 2 0,-1.3; 3 0.95,-1.3; 4 0.95,1.3; 5 -0.95,1.3
CRYSTAL-SMD-3.2X1.5MM = smd 1 x 1.8: P$1 -1.25,0; P$2 1.25,0

### Placement (x,y rotation side)
BASEBAND1  62,25 90 top
C1  47,9 270 bottom
C2  39.47,41.93 0 top  (outside the outline)
C3  15.66,40.93 0 top  (outside the outline)
C4  40.31,2.31 0 top
C5  18.85,49.93 0 top  (outside the outline)
C6  49,26 90 top
C7  67,13 270 top
C8  58,6 270 top
C9  67,21 90 top
C13  20.31,22.5 270 top
C17  35.69,5.31 0 top
C18  35.88,2.31 0 top
C19  35,8 270 top
C20  81.07,54.31 0 top  (outside the outline)
C21  7,8 180 top
C22  33,8 90 top
C23  38,8 90 top
C28  17,19 180 top
CFIL1  55,27 180 top
CFIL4  54.8,16.94 180 top
D1  36,22 90 top
D3  52,20 90 top
D8  34,22 90 top
D9  30,22 90 top
D10  32,22 90 top
FD1  -24.97,63.74 0 top  (outside the outline)
FD2  -26.51,63.74 0 top  (outside the outline)
FD3  -28.05,63.74 0 top  (outside the outline)
FD4  -29.59,63.74 0 top  (outside the outline)
G1  33.67,18.84 0 bottom
H3  -30.66,57.83 0 top  (outside the outline)
H4  -22.51,57.72 0 top  (outside the outline)
IN2  67,17 270 top
J1  42,30 180 top
J2  3,6 0 top
J3  29,9 180 top
J5  21.09,26.04 0 top
J7  3,26 0 top
J9  3,29 0 top
J10  33.04,24.79 180 top
J11  20.72,10.28 180 top
J13  3,3 0 top
J14  21,29 0 top
JP1  49.13,19.28 90 top
R1  23,19 180 top
R2  52,2 0 top
R3  30,11 0 bottom
R4  11,8 180 top
R5  58.09,53.12 0 top  (outside the outline)
R6  46,30 0 top
R7  32,18 270 top
R8  63,13 90 top
R9  49,4 0 top
R10  30,13 0 bottom
R11  9,20 0 bottom
R12  10,23 0 bottom
R13  63,16 0 top
R15  30,18 270 top
R16  34,18 270 top
R17  43.76,22.93 0 top
R18  39.05,23.07 180 top
R19  6,23 0 bottom
R20  36.33,78.93 0 top  (outside the outline)
R21  65.52,45.93 0 top  (outside the outline)
REGULATOR1  55,22 180 top
RSET2  60.93,10.17 0 top
RSET3  58,13 90 top
S1  18.07,15.15 270 top
TD3  62,20 268.9 top
TD_VCC1  50,12 90 top
TDBIA_VCC  54,14 270 top
TDBIAS  54,10 90 top
TDBIAS_VCC  58,22 0 top
TP1  5,15 0 bottom
TP2  8,16 0 bottom
TP3  12,15 0 bottom
TP4  10,16 0 bottom
TP5  26,28 0 top
TP6  26,30 0 top
TP8  52,4 0 top
TUNNELDIODE2  67,6 0 top
U1  45,5 0 top
U2  46,26 180 top
U4  7.45,16.33 180 top
U5  38,14 180 top
U6  33,29 0 bottom
U$1  44.1,10.18 0 top
Y2  2.85,17.44 270 bottom

### Tracks (layer width: path | path; a pad name or v marks a point on that pad's centre or on a via)
3.3V  (9 unrouted)
  Top 0.203: JP1.3 48.18,21.82 46.95,23.05 U2.5 48.2,24.7 C6.1
10
  Top 0.203: U4.D40 5,11.78 5,6.54 J2.2
!RESET  (2 unrouted)
  Top 0.203: U4.~RST 7.5,20.08 7.5,21.23 9.43,23.16 9.43,26.49 10.13,27.19 13.65,27.19 14.35,26.49 14.35,23.65 16.7,21.3 16.7,20.59 17.85,19.43 C28.1 18.87,17.98 S1.4 S1.3 17.42,11.65 17.42,10.6 18.18,9.84 J11.10 19.82,8 23.86,8 J2.10
!RTS  (via drill 0.35)  (2 unrouted)
  Top 0.203: C21.1 7.85,9.85 v8,10
  Bottom 0.203: U6.4 35.15,28.4 34.65,28.4 33.24,27 33,27 26.37,20.37 26.37,15.74 26.63,15.47 26.63,10.74 24.42,8.53 10.58,8.53 9.11,10 v8,10
ANT2
  Top 0.203: C8.+ TUNNELDIODE2.1 C7.2
BBIN_R  (1 unrouted)
BIN
  Top 0.203: IN2.1 C9.1 66.81,19.96 TD3.+ | TD3.+ 64.05,16.2 R13.2 64,15.85 64,14.9 R8.2 | BASEBAND1.1 63.27,22.73 64.05,21.95 TD3.+
BOOT  (via drill 0.35)
  Top 0.203: C21.2 6,8.15 6,11.78 U4.BOOT 5.95,13.95 v6,14
  Bottom 0.203: R19.2 6,22.15 v6,14
CC1  (1 unrouted)
CC2  (1 unrouted)
D+1  (2 unrouted)
D-1  (2 unrouted)
GND  (via drill 0.35)  (59 unrouted)
  Top 0.203: J9.1 J9.2 J9.3 J9.4 J9.5 J9.6 J9.7 J14.1 J14.2 | J13.1 J13.2 J13.3 J13.4 J13.5 J13.6 J13.7 J13.8 J13.9 J13.10 J13.11 J13.12 | U4.GND@59 2.95,22.95 3,23
  other vias: 54,6 54,6 54,6
N$1  (via drill 0.35)  (3 unrouted)
  Top 0.406: v41,8 41,7 42.05,5.95 U1.1
  Bottom 0.406: G1.POSITIVE@2 41,13.47 v41,8
N$2  (1 unrouted)
N$3
  Top 0.203: U1.4 46.2,4 R9.1
N$4  (via drill 0.35)
  Top 0.203: v20,20 25,20 27,18 v27,17 | U5.2 35.33,13.68 v35,14
  Bottom 0.203: R11.1 10.49,19.36 19.36,19.36 v20,20 | v27,17 32,17 v35,14
N$5
  Top 0.203: C7.1 IN2.2
N$6  (via drill 0.35)
  Top 0.203: U5.5 38.79,14.97 38.36,14.54 38.36,12.36 v38,12
  Bottom 0.203: R3.1 31.85,12 v38,12
N$7  (via drill 0.35)  (1 unrouted)
  Top 0.203: U4.XO 11.33,18.33 10.64,17.64 5.64,17.64 v5,17
  Bottom 0.203: Y2.P$2 3.66,17 v5,17
N$8  (via drill 0.35)  (1 unrouted)
  Top 0.203: U4.XI 10.83,18.83 10,18 v5,18
  Bottom 0.203: Y2.P$1 3.31,18.69 4,18 v5,18
N$9  (1 unrouted)
N$11  (1 unrouted)
N$12  (1 unrouted)
N$14  (via drill 0.35)
  Top 0.203: R1.1 24,19 v27,16 | v34,14 34.98,14.97 U5.4
  Bottom 0.203: v27,16 29,14 v34,14
N$15  (via drill 0.35)
  Top 0.203: U5.3 37.67,14.32 38,14 38,13 37,12 36,12 v35,13
  Bottom 0.203: R10.1 v35,13
PDMCLK
  Top 0.203: J2.3 7.23,6 6.03,4.81 2.51,4.81 1.81,5.51 1.81,11.81 3,13 3,18.72 3.9,19.62 3.9,20.78 U4.~D37
PDMDATA
  Top 0.203: J2.4 9.07,4.45 2.36,4.45 1.45,5.36 1.45,11.95 2.64,13.14 2.64,20.28 1.81,21.11 1.81,26.49 2.51,27.19 3.49,27.19 4.19,26.49 4.19,25.31 4.81,24.7 4.81,20.97 U4.D36
RXI-0_R  (3 unrouted)
SHLD  (3 unrouted)
STAT
  Top 0.203: TP8.1 R9.2 49.85,3.1 R2.1
SWDCK  (via drill 0.35)
  Top 0.203: U4.SWDCK 4,13.18 v4,14
  Bottom 0.203: TP1.1 v4,14 6.64,11.36 9.54,11.36 12.01,8.88 21.04,8.88 21.8,9.64 J11.4
SWDIO  (via drill 0.35)
  Top 0.203: U4.SWDIO 7.45,13.45 v8,14
  Bottom 0.203: TP2.1 v8,14 10.29,11.71 23.54,11.71 24.02,11.23 24.02,10.6 23.26,9.84 J11.2
TDBIAS
  Top 0.203: 58,12 RSET3.1 58.15,12 62.9,12 R8.1 63,11 62.17,10.17 RSET2.2 | 58,12 58,11 57,10 TDBIAS.TP | TD_VCC1.1 58,12
TDBIAS_VCC
  Top 0.203: TDBIA_VCC.TP 57.85,14 RSET3.2 58,16 57.06,16.94 CFIL4.1 56,17.2 56,20.65 REGULATOR1.5 56.7,20.7 TDBIAS_VCC.TP
TXO-0_R  (via drill 0.35)  (2 unrouted)
  Top 0.203: v17,30 17.88,30.88 25.12,30.88 TP6.1
  Bottom 0.203: R12.1 12.66,24.81 13.65,24.81 14.35,25.51 14.35,26.35 15.81,27.81 16.19,27.81 17,28.61 v17,30
V_USB  (1 unrouted)
  Top 0.203: J10.VBUS1 35.49,26.49 37,28 | 37,28 41,28 43,26 46,26 46.95,26.95 U2.1 46.95,29.9 R6.2 48,30 52,26 D3.A | J10.VBUS2 30.59,25.59 33,28 37,28
VCC  (via drill 0.35)  (1 unrouted)
  Top 0.203: JP1.1 49.13,15.13 48,14 44,14 43.15,13.15 U$1.5 43.15,10.85 44,10 45,10 46,11 47,11 v49,9 | R2.2 54,3.15 54,4 52,6 v50,6
  Bottom 0.203: v50,6 49,7 v49,9
VDD  (5 unrouted)
  Top 0.203: REGULATOR1.1 55.95,25.05 54.06,26.94 CFIL1.2 REGULATOR1.3 53,22.25 53,21 51.28,19.28 JP1.2 | 31.25,14.94 32.26,14.94 36.6,19.28 JP1.2 | J2.9 23.67,6 25.22,4.45 28.54,4.45 29.59,5.51 29.59,9.09 | 31.25,14.94 29.59,13.29 29.59,9.09 | JP1.2 45.17,15.32 41,15.32 | U5.6 40,14.32 41,15.32 | J11.1 25.35,13 25.35,13.78 26.5,14.94 31.25,14.94 | J3.2 29.59,9.09 | U5.8 40.02,13.03 41,14 41,15.32
VIN  (via drill 0.35)  (2 unrouted)
  Top 0.203: D3.C 52,16 50,14 50,8 47.95,5.95 U1.5 | U$1.1 43.15,7.85 44,7 45.1,7 U1.5 | U$1.3 45.05,7.95 46.15,6.85 U1.5 | U1.5 47,6.8 v47,7
  Bottom 0.203: C1.2 v47,7
VREG_EN1
  Top 0.203: J1.1 R6.1 45.05,29.9 U2.3
~4
  Top 0.203: U4.~D18 11.95,24.79 J7.5
~6
  Top 0.203: U4.~D43 6.45,24.37 J7.3
~7
  Top 0.203: U4.~D42 5.95,25.59 J7.2
~8
  Top 0.203: U4.D38 4.45,24.55 J7.1
~9
  Top 0.203: U4.~D39 4.45,7.45 J2.1
~A0  (via drill 0.35)
  Top 0.203: U4.~AD13 12,16.48 v12,17
  Bottom 0.203: v12,17 13.37,18.37 20.26,18.37 20.63,18.74 20.63,23.04 J5.2
~A1  (via drill 0.35)
  Top 0.203: J11.6 22.01,8.36 25.19,8.36 27.05,6.49 27.05,5.51 26.35,4.81 25.37,4.81 24.67,5.51 24.67,6.34 23.36,7.64 19.64,7.64 18.4,8.88 17.86,8.88 17,9.75 17,12 16,13 16,15 14.67,16.33 U4.~AD33/SWO 15.33,16.33 v16,17
  Bottom 0.203: v16,17 17.01,18.01 20.41,18.01 20.99,18.59 20.99,21.82 24.01,24.85 24.12,24.85 24.82,25.55 24.82,26.53 24.12,27.23 23.14,27.23 21.94,26.04 J5.1
~A2  (via drill 0.35)
  Top 0.203: U4.~AD11 13.2,17.38 14.36,17.38 15,18.02 15,20 v16,21
  Bottom 0.203: v16,21 16,23.76 J7.7
~A3  (via drill 0.35)
  Top 0.203: U4.~AD29 14.64,18.52 14.64,20.15 15,20.5 v15,22
  Bottom 0.203: v15,22 15,25.3 J7.6
~A5
  Top 0.203: U4.~AD31 10.45,25.83 J7.4
~A14
  Top 0.203: J2.6 13,8.7 13,10 12,11 9.92,11 9.45,11.47 U4.~AD35
~A15
  Top 0.203: J2.7 15,9.24 15,13 14.67,13.33 U4.~AD32
~A16
  Top 0.203: J2.8 18.78,8 17,8 15.36,9.64 15.36,13.28 14.36,14.28 13.2,14.28 U4.~AD12
~D19/LED  (1 unrouted)
~D25/SDA2  (via drill 0.35)
  Top 0.203: U4.~D25 13.9,13.88 v12.12,13.88 | J3.3 28.05,9.45 28.05,9.78 26.83,11 v26,11
  Bottom 0.203: TP3.1 12.12,14.88 v12.12,13.88 13.58,12.42 23.84,12.42 25.26,11 v26,11
~D27/SCL2  (via drill 0.35)
  Top 0.203: U4.~D27 11.95,13.05 11,14 v10,14 | J3.4 27.5,8.5 27,8 26.05,8 25.05,9 25,9 v25,10
  Bottom 0.203: TP4.1 v10,14 11.93,12.07 23.69,12.07 24.38,11.38 24.38,10.62 v25,10
~MISO  (via drill 0.35)
  Top 0.203: U4.~D6 14.64,12.14 14.64,8.74 16.89,6.49 16.89,5.11 v17,5
  Bottom 0.203: v17,5 17.55,5 17.75,4.81 18.73,4.81 19.43,5.51 19.43,6.43 21.17,8.17 24.57,8.17 27.4,11 R3.2
~MOSI  (via drill 0.35)
  Top 0.203: 9,11.78 U4.D7 9.09,11.69 9.09,11.32 9.79,10.63 10.26,10.63 11.05,9.85 11.05,7.39 11.97,6.47 11.97,5.51 13.1,4.37 21.37,4.37 21.81,4.81 v22,5
  Bottom 0.203: v22,5 22.13,5.13 22.13,6.49 23.45,7.82 27.38,7.82 29.95,10.39 29.95,11.61 29.15,12.41 R10.2
~RXI-0  (via drill 0.35)
  Top 0.203: R4.2 10,8.15 v10,10 | U4.RXI-0 3.95,10.95 v3,10
  Bottom 0.203: v10,10 9,11 8,11 6,9 4,9 v3,10
~SCK  (via drill 0.35)
  Top 0.203: U4.~D5 9.37,13.55 9.37,14.26 11,15.89 v11,17 | v20,19 R1.2
  Bottom 0.203: v20,19 13,19 v11,17
~SPI_CS  (via drill 0.35)
  Top 0.203: U4.D8 7.95,12.99 8.14,13.18 8.18,13.18 9,14 v9,15
  Bottom 0.203: R11.2 8.15,17.11 8.89,16.37 8.89,15.11 v9,15
~TXO-0  (via drill 0.35)
  Top 0.203: 7,11.78 U4.TXO-0 6.95,14.95 v7,15
  Bottom 0.203: v7,15 7,20.85 R12.2